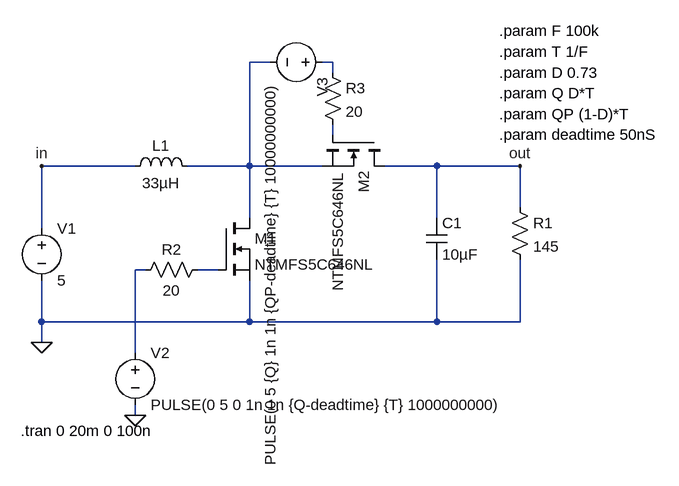
[diagram p0: schematic boostconvsync.asc]
boostconvsync.asc, the LTspice schematic file:
Version 4
SHEET 1 932 680
WIRE 304 -96 272 -96
WIRE 400 -96 384 -96
WIRE 400 -80 400 -96
WIRE 400 16 400 0
WIRE 96 64 -48 64
WIRE 272 64 272 -96
WIRE 272 64 176 64
WIRE 384 64 272 64
WIRE 560 64 480 64
WIRE 688 64 560 64
WIRE 688 128 688 64
WIRE 272 144 272 64
WIRE 560 144 560 64
WIRE -48 160 -48 64
WIRE 112 224 96 224
WIRE 224 224 192 224
WIRE -48 304 -48 240
WIRE 272 304 272 240
WIRE 272 304 -48 304
WIRE 560 304 560 208
WIRE 560 304 272 304
WIRE 688 304 688 208
WIRE 688 304 560 304
WIRE -48 336 -48 304
WIRE 96 352 96 224
WIRE 96 448 96 432
FLAG -48 336 0
FLAG 96 448 0
FLAG 688 64 out
FLAG -48 64 in
SYMBOL voltage -48 144 R0
WINDOW 123 0 0 Left 0
WINDOW 39 0 0 Left 0
SYMATTR InstName V1
SYMATTR Value 5
SYMBOL nmos 224 144 R0
SYMATTR InstName M1
SYMATTR Value NTMFS5C646NL
SYMBOL voltage 96 336 R0
WINDOW 123 0 0 Left 0
WINDOW 39 0 0 Left 0
SYMATTR InstName V2
SYMATTR Value PULSE(0 5 0 1n 1n {Q-deadtime} {T} 1000000000)
SYMBOL ind 80 80 R270
WINDOW 0 32 56 VTop 2
WINDOW 3 5 56 VBottom 2
SYMATTR InstName L1
SYMATTR Value 33µH
SYMBOL cap 544 144 R0
SYMATTR InstName C1
SYMATTR Value 10µF
SYMBOL res 672 112 R0
SYMATTR InstName R1
SYMATTR Value 145
SYMBOL nmos 480 16 R90
SYMATTR InstName M2
SYMATTR Value NTMFS5C646NL
SYMBOL voltage 400 -96 R90
WINDOW 123 0 0 Left 0
WINDOW 39 0 0 Left 0
SYMATTR InstName V3
SYMATTR Value PULSE(0 5 {Q} 1n 1n {QP-deadtime} {T} 10000000000)
SYMBOL res 208 208 R90
WINDOW 0 0 56 VBottom 2
WINDOW 3 32 56 VTop 2
SYMATTR InstName R2
SYMATTR Value 20
SYMBOL res 384 -96 R0
SYMATTR InstName R3
SYMATTR Value 20
TEXT -80 472 Left 2 !.tran 0 20m 0 100n
TEXT 656 -112 Left 2 !.param T 1/F
TEXT 656 -144 Left 2 !.param F 100k
TEXT 656 -80 Left 2 !.param D 0.73
TEXT 656 -48 Left 2 !.param Q D*T
TEXT 656 -16 Left 2 !.param QP (1-D)*T
TEXT 656 16 Left 2 !.param deadtime 50nS

The netlist it stands for:
* boostconvsync.asc
V1 in 0 5
M1 N001 N005 0 0 NTMFS5C646NL
V2 N004 0 PULSE(0 5 0 1n 1n {Q-deadtime} {T} 1000000000)
L1 in N001 33µH
C1 out 0 10µF
R1 out 0 145
M2 out N003 N001 N001 NTMFS5C646NL
V3 N002 N001 PULSE(0 5 {Q} 1n 1n {QP-deadtime} {T} 10000000000)
R2 N005 N004 20
R3 N002 N003 20
.model NMOS NMOS
.model PMOS PMOS
.lib standard.mos
.tran 0 20m 0 100n
.param T 1/F
.param F 100k
.param D 0.73
.param Q D*T
.param QP (1-D)*T
.param deadtime 50nS
.backanno
.end